# Altium schematic sheet ltk-mw-rx.SchDoc: MW Bench - Receiver
size A3; Organization: Altium Limited; DocumentNumber: 2; Revision: 3.0; SheetNumber: 2; SheetTotal: 3
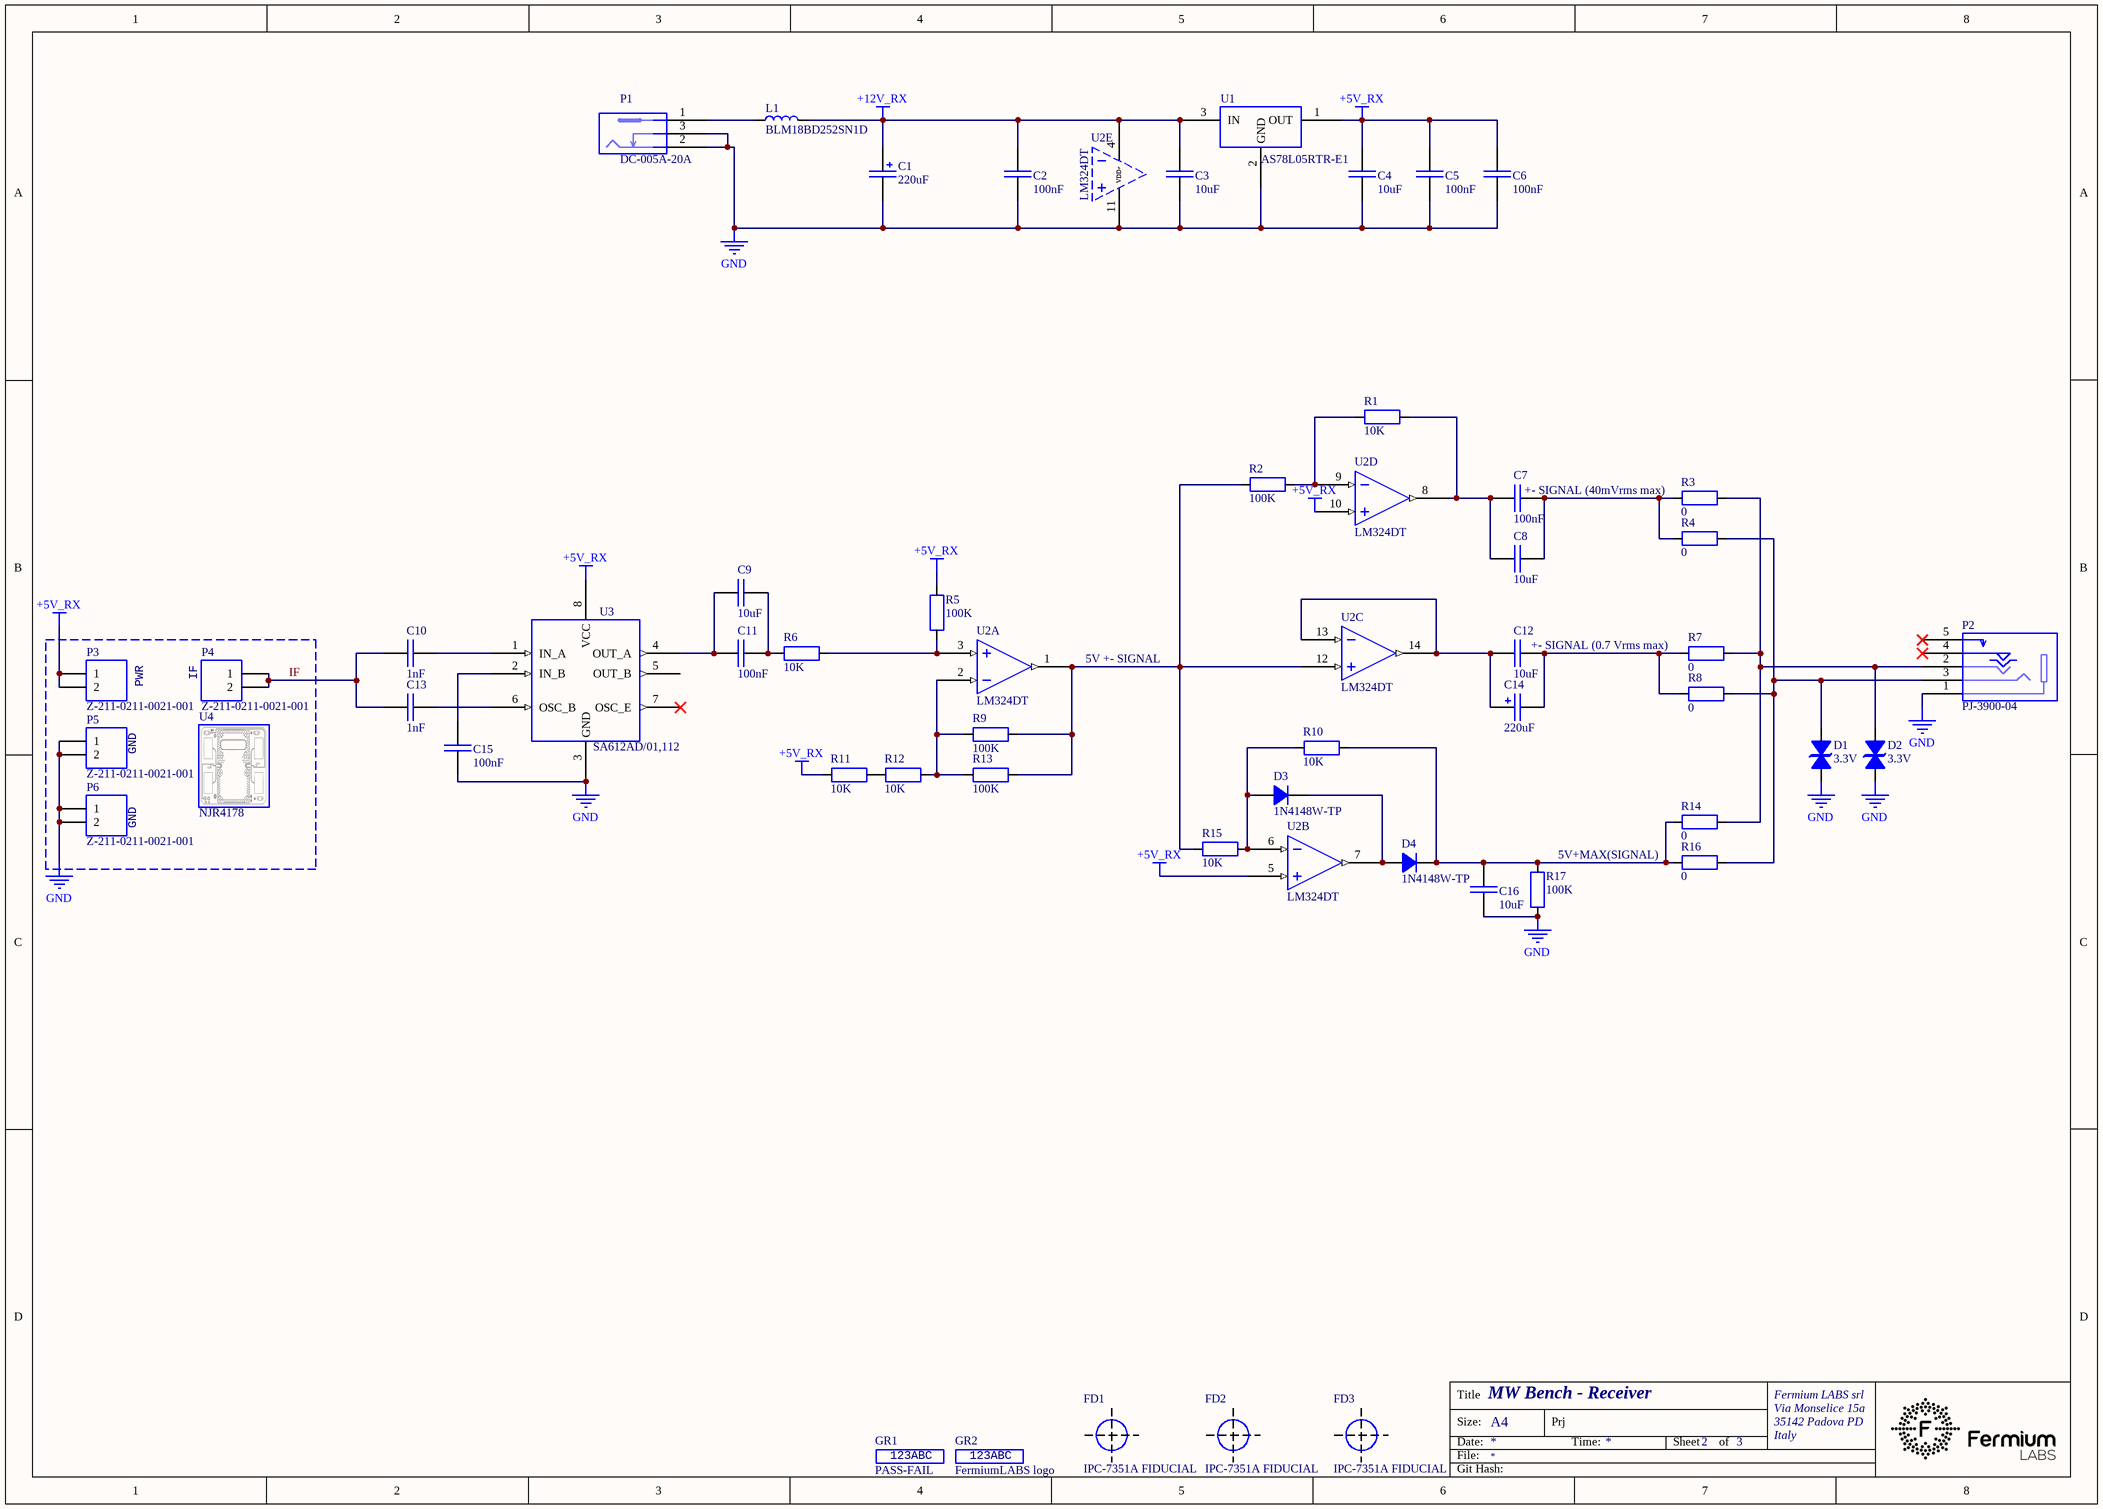
[diagram p0: ltk-mw-rx.SchDoc]

## Parts
C1  220uF  [3924B366-8672-45E9-B0BE-62DACC24E783]
C2  100nF  [CAP 0603_1608]
C3  10uF  [CAP 0805_2012]
C4  10uF  [CAP 0805_2012]
C5  100nF  [CAP 0603_1608]
C6  100nF  [CAP 0603_1608]
C7  100nF  [CAP 0603_1608]
C8  10uF  [CAP 0805_2012]
C9  10uF  [CAP 0805_2012]
C10  1nF  [CAP 0603_1608]
C11  100nF  [CAP 0603_1608]
C12  10uF  [CAP 0805_2012]
C13  1nF  [CAP 0603_1608]
C14  220uF  [3924B366-8672-45E9-B0BE-62DACC24E783]
C15  100nF  [CAP 0603_1608]
C16  10uF  [CAP 0805_2012]
D1  3.3V  [SOD523F]
D2  3.3V  [SOD523F]
D3  1N4148W-TP  [SOD-123]
D4  1N4148W-TP  [SOD-123]
FD1  IPC-7351A FIDUCIAL  [FIDUCIAL-IPC-7351A]  (no BOM)
FD2  IPC-7351A FIDUCIAL  [FIDUCIAL-IPC-7351A]  (no BOM)
FD3  IPC-7351A FIDUCIAL  [FIDUCIAL-IPC-7351A]  (no BOM)
GR1  PASS-FAIL  [0B1556B7-A534-4801-B57D-01EFA34B1205]  (no BOM)
GR2  FermiumLABS logo  [5394DE47-A0E8-4329-8464-7791B7C19310]  (no BOM)
L1  BLM18BD252SN1D  [FER 0603_1608]
P1  DC-005A-20A  [F0972D8A-C5C0-4A84-836D-A9666EE65C2D]
P2  PJ-3900-04  [7EF2B92C-0FC9-4C85-B662-5CEC65BFCCC4]
P3  Z-211-0211-0021-001  [0FBEB40D-2B6D-43C7-945F-A2D40A82B953]
P4  Z-211-0211-0021-001  [0FBEB40D-2B6D-43C7-945F-A2D40A82B953]
P5  Z-211-0211-0021-001  [0FBEB40D-2B6D-43C7-945F-A2D40A82B953]
P6  Z-211-0211-0021-001  [0FBEB40D-2B6D-43C7-945F-A2D40A82B953]
R1  10K  [RES 0603_1608]
R2  100K  [RES 0603_1608]
R3  0  [RES 0603_1608]
R4  0  [RES 0603_1608]
R5  100K  [RES 0603_1608]
R6  10K  [RES 0603_1608]
R7  0  [RES 0603_1608]
R8  0  [RES 0603_1608]
R9  100K  [RES 0603_1608]
R10  10K  [RES 0603_1608]
R11  10K  [RES 0603_1608]
R12  10K  [RES 0603_1608]
R13  100K  [RES 0603_1608]
R14  0  [RES 0603_1608]
R15  10K  [RES 0603_1608]
R16  0  [RES 0603_1608]
R17  100K  [RES 0603_1608]
U1  AS78L05RTR-E1  [E733EFB9-FE91-4AE9-9197-29251971C3DC]
U2  LM324DT  [34355DA5-B1DA-47C2-A88A-ECF82120A4F7]  (parts A,B,C,D,E of 5)
U3  SA612AD/01,112  [TI SOIC-8 D]
U4  NJR4178  [25B19271-CD6F-4BC8-A99B-F617D566DC9C]

## Nets
+5V_RX: C4.2 C5.2 C6.2 P3.1 P3.2 R5.1 R11.2 U1.1(OUT) U2.5(IN+) U2.10(IN+) U3.8(VCC)
+12V_RX: C1.1 C2.2 C3.2 L1.2 U1.3(IN) U2.4(VDD+)
GND: C1.2 C2.1 C3.1 C4.1 C5.1 C6.1 C15.2 C16.2 D1.2 D2.2 P1.2 P1.3 P2.1(GND) P5.1 P5.2 P6.1 P6.2 R17.1 U1.2(GND) U2.11(VDD-) U3.3(GND)
IF: C10.1 C13.1 P4.1 P4.2
NetC7_1: C7.1 C8.1 R1.1 U2.8(OUT)
NetC7_2: C7.2 C8.2 R3.2 R4.2
NetC9_1: C9.1 C11.1 U3.4(OUT_A)
NetC9_2: C9.2 C11.2 R6.2
NetC10_2: C10.2 U3.1(IN_A)
NetC12_1: C12.1 C14.2 R7.2 R8.2
NetC12_2: C12.2 C14.1 U2.13(IN-) U2.14(OUT)
NetC13_2: C13.2 U3.6(OSC_B)
NetC15_1: C15.1 U3.2(IN_B)
NetC16_1: C16.1 D4.1(K) R10.1 R14.2 R16.2 R17.2
NetD1_1: D1.1 P2.3(L) R4.1 R8.1 R16.1
NetD2_1: D2.1 P2.2(R) R3.1 R7.1 R14.1
NetD3_1: D3.1(K) D4.2(A) U2.7(OUT)
NetD3_2: D3.2(A) R10.2 R15.1 U2.6(IN-)
NetL1_1: L1.1 P1.1
NetR1_2: R1.2 R2.1 U2.9(IN-)
NetR2_2: R2.2 R9.1 R13.1 R15.2 U2.1(OUT) U2.12(IN+)
NetR5_2: R5.2 R6.1 U2.3(IN+)
NetR9_2: R9.2 R12.1 R13.2 U2.2(IN-)
NetR11_1: R11.1 R12.2

Not connected (* = marked no-connect by the designer): P2 4(AUX)* 5(AUX)*; U3 5(OUT_B) 7(OSC_E)*

## Notes on the sheet
- (near C7) +- SIGNAL (40mVrms max)
- +- SIGNAL (0.7 Vrms max)
- PWR
- (near P4) IF
- 5V +- SIGNAL
- GND
- (near R17) 5V+MAX(SIGNAL)
- Title
- Fermium LABS srl
- Size:
- Date:
- File:
- A4
- Prj
- Time:
- Sheet
- of
- Via Monselice 15a
- 35142 Padova PD
- Italy
- Git Hash:
- (in symbol 50f8ea88-0034-49fe-a263-d8e97bc35e2f) 123ABC
- (in symbol d1abe19f-3fed-4f20-b2ed-afc0ffbc6628) 123ABC

## Library data of the parts
C1 C14 = 1a28df19-6d3e-4a71-836c-f22920f8e8ab: CAP  THT ELEC 220uF 25V 20%; Manufacturer 1: Rubycon; Manufacturer Part Number 1: 25PK220MEFC-6.3*11; id: 14782; S 1: LCSC; SPN 1: C109337; Part Number: 1a28df19-6d3e-4a71-836c-f22920f8e8ab; ComponentLink1Description: Datasheet; ComponentLink1URL: http://localhost:8080/static/files/Rubycon-220uF-25V_C109337_12019-03-10_214953.757848.pdf?Rubycon-220uF-25V_C109337 (1).pdf; Value: 220uF
C2 C5-C7 C11 C15 = 02841f84-ac15-41b5-9e17-915f8f067828: CAP SMD MLCC 100nF 25V 0603 X7R; Manufacturer 1: Samsung Electro-Mechanics; Manufacturer Part Number 1: CL10B104KA8NNNC; id: 14784; S 1: LCSC; SPN 1: C1590; Part Number: 02841f84-ac15-41b5-9e17-915f8f067828; ComponentLink1Description: Datasheet; ComponentLink1URL: http://localhost:8080/static/files/Samsung-Electro-Mechanics-CL10B104KA8NNNC_C15902019-03-10_215548.826887.pdf?Samsung-Electro-Mechanics-CL10B104KA8NNNC_C1590.pdf; Value: 100nF
C3 C4 C8 C9 C12 C16 = 1ffbe5a9-0884-4740-bdad-20a6a98400e6: CAP SMD MLCC 10uF 25V 0805 X5R; Manufacturer 1: Samsung Electro-Mechanics; Manufacturer Part Number 1: CL21A106KAYNNNE; id: 14779; S 1: LCSC; SPN 1: C84416; SPN 2: C15850; Part Number: 1ffbe5a9-0884-4740-bdad-20a6a98400e6; ComponentLink1Description: Datasheet; ComponentLink1URL: http://localhost:8080/static/files/Samsung-Electro-Mechanics-CL21A106KAYNNNE_C158502019-03-10_213827.610739.pdf?Samsung-Electro-Mechanics-CL21A106KAYNNNE_C15850.pdf; Value: 10uF; Manufacturer 2: Murata; Manufacturer Part Number 2: GRM21BR61E106KA73L; S 2: LCSC
C10 C13 = 0eca2548-3630-4fea-a3d5-94248c1cae74: CAP SMD MLCC 1nF 50V 0603 X7R; Manufacturer 1: Samsung Electro-Mechanics; Manufacturer Part Number 1: CL10B102KB8NNNC; id: 14785; S 1: LCSC; SPN 1: C1588; Part Number: 0eca2548-3630-4fea-a3d5-94248c1cae74; ComponentLink1Description: Datasheet; ComponentLink1URL: http://localhost:8080/static/files/Samsung-Electro-Mechanics-CL10B102KB8NNNC_C1588_12019-03-10_215732.131818.pdf?Samsung-Electro-Mechanics-CL10B102KB8NNNC_C1588 (1).pdf; Value: 1nF
D1 D2 = d6266fd0-7428-4fb9-a062-338cdce926fd: DIODE SMD TVS 3.3V BIDIRECTIONAL SOD-523; Manufacturer 1: Born Semiconductor; Manufacturer Part Number 1: PESD3V3S1BA-N; id: 14798; S 1: LCSC; SPN 1: C85377; SPN 2: C316037; Part Number: d6266fd0-7428-4fb9-a062-338cdce926fd; ComponentLink1Description: Datasheet; ComponentLink1URL: http://localhost:8080/static/files/Bourne-Semicon-Shenzhen-PESD3V3S1BA-N_C3160372019-04-07_002431.794112.pdf?Bourne-Semicon-Shenzhen-PESD3V3S1BA-N_C316037.pdf; Value: 3.3V; ComponentLink2Description: Datasheet; ComponentLink2URL: http://localhost:8080/static/files/Nexperia-PESD3V3S1UB115-datasheet2019-08-16_201415.198759.pdf?Nexperia-PESD3V3S1UB,115-datasheet.pdf; Manufacturer 2: Nexperia; Manufacturer Part Number 2: PESD3V3S1UB,115; S 2: LCSC
D3 D4 = 5e920700-75df-48e3-84dd-8f9f777caed8: DIODE SMD 100V 150mA 1.5Vf SOD-123 4148; Manufacturer 1: MCC; id: 14795; S 1: LCSC; SPN 1: C77978; Part Number: 5e920700-75df-48e3-84dd-8f9f777caed8; ComponentLink1Description: Datasheet; ComponentLink1URL: http://localhost:8080/static/files/Micro-Commercial-Components-MCC-1N4148W-TP_C779782019-04-06_215019.428643.pdf?Micro-Commercial-Components-MCC-1N4148W-TP_C77978.pdf; Manufacturer Part Number 1: 1N4148W-TP
FD1-FD3 = 19da4612-eb95-43bb-9984-553a52b2a224: GRAPHICS FIDUCIAL IPC-7351A; id: 14800; Part Number: 19da4612-eb95-43bb-9984-553a52b2a224
GR1 = d1abe19f-3fed-4f20-b2ed-afc0ffbc6628: GRAPHICS PASS-FAIL MARK; id: 14801; Part Number: d1abe19f-3fed-4f20-b2ed-afc0ffbc6628
GR2 = 50f8ea88-0034-49fe-a263-d8e97bc35e2f: GRAPHICS LOGO FERMIUM LABS SRL; id: 14799; Part Number: 50f8ea88-0034-49fe-a263-d8e97bc35e2f
L1 = c9e30ae8-9d5b-4135-a079-b1147da846d8: FER SMD CHIP 0603 400mA 1k@100MHz 500mOhm; Manufacturer 1: Murata; id: 14786; S 1: LCSC; SPN 1: C77668; Part Number: c9e30ae8-9d5b-4135-a079-b1147da846d8; ComponentLink1Description: Datasheet; ComponentLink1URL: http://localhost:8080/static/files/Murata-Electronics-BLM18AG102SN1D_C858242019-03-10_220021.186607.pdf?Murata-Electronics-BLM18AG102SN1D_C85824.pdf; Manufacturer Part Number 1: BLM18BD252SN1D
P1 = b53db51a-1725-412b-9039-fa7a45c7c438: CONN THT DC JACK 0.5A 30VDC 5Kcycles; Manufacturer 1: HRO Electronics; id: 14780; S 1: LCSC; SPN 1: C191049; Part Number: b53db51a-1725-412b-9039-fa7a45c7c438; ComponentLink1Description: Datasheet; ComponentLink1URL: http://localhost:8080/static/files/Korean-Hroparts-Elec-DC-005A-20A_C191049_22019-03-10_214231.486078.pdf?Korean-Hroparts-Elec-DC-005A-20A_C191049 (2).pdf; Manufacturer Part Number 1: DC-005A-20A
P2 = 80507a24-5d7c-4cf5-953e-f54832d54564: CONN THT 3.5mm AUDIO STEREO AUX SWITCH; Manufacturer 1: HRO Electronics; id: 14793; S 1: LCSC; SPN 1: C151839; Part Number: 80507a24-5d7c-4cf5-953e-f54832d54564; ComponentLink1Description: Datasheet; ComponentLink1URL: http://localhost:8080/static/files/Korean-Hroparts-Elec-PJ-3900-04_C1518392019-04-10_231144.687617.pdf?Korean-Hroparts-Elec-PJ-3900-04_C151839.pdf; Manufacturer Part Number 1: PJ-3900-04
P3-P6 = fb9043ef-1dd5-4a9c-8c1a-da0c667690ac: CONN THT PIN HEADER 2P MALE 2.54mm; Manufacturer 1: Nextronics Engineering; id: 14796; S 1: LCSC; SPN 1: C225477; SPN 2: C152154; SPN 3: C124375; Part Number: fb9043ef-1dd5-4a9c-8c1a-da0c667690ac; ComponentLink1Description: Datasheet; ComponentLink1URL: http://localhost:8080/static/files/Shenzhen-Cankemeng-Headers-Pins-1-2P-2-54mm-Straight-line_C1243752019-04-06_220043.339618.pdf?Shenzhen-Cankemeng-Headers-Pins-1-2P-2-54mm-Straight-line_C124375.pdf; ComponentLink2Description: Datasheet; ComponentLink2URL: http://localhost:8080/static/files/Nextronics-Engineering-Z-211-0211-0021-001_C1521542019-04-06_220050.159477.pdf?Nextronics-Engineering-Z-211-0211-0021-001_C152154.pdf; ComponentLink3Description: Datasheet; ComponentLink3URL: http://localhost:8080/static/files/Changjiang-Connectors-A2541WV-2P_C2254772019-04-06_220058.382973.pdf?Changjiang-Connectors-A2541WV-2P_C225477.pdf; Manufacturer 2: Changjiang Connectors; Manufacturer 3: Shenzhen Cankemeng; Manufacturer Part Number 1: Z-211-0211-0021-001; Manufacturer Part Number 2: A2541WV-2P; Manufacturer Part Number 3: ---; S 2: LCSC; S 3: LCSC
R1 R6 R10-R12 R15 = 93242766-ba1d-462d-b58f-ce1dfc4129c8: RES SMD 10K OHM 1% 1/10W 0603; Manufacturer 1: Yageo; Manufacturer Part Number 1: RC0603FR-0710KL; id: 12101; S 1: LCSC; SPN 1: C98220; Part Number: 93242766-ba1d-462d-b58f-ce1dfc4129c8; Value: 10K
R2 R5 R9 R13 R17 = 76af10b3-9d85-4b5c-a2d6-26cc74f432f7: RES SMD 100K OHM 1% 1/10W 0603; Manufacturer 1: Yageo; Manufacturer Part Number 1: RC0603FR-07100KL; id: 12746; S 1: LCSC; SPN 1: C14675; Part Number: 76af10b3-9d85-4b5c-a2d6-26cc74f432f7; Value: 100K
R3 R4 R7 R8 R14 R16 = 6ae227f9-847f-4766-8522-e11a83531204: RES SMD 0 OHM 5% 1/10W 0603; Manufacturer 1: Yageo; Manufacturer Part Number 1: RC0603JR-070RL; id: 11973; S 1: LCSC; SPN 1: C95177; Part Number: 6ae227f9-847f-4766-8522-e11a83531204; Value: 0
U1 = fd64863e-487f-4688-b264-696c0ba5456b: IC SMD LINEAR VOLTAGE REGULATOR 5V 100mA SOT-89; Manufacturer 1: Diodes Inc.; id: 14783; S 1: LCSC; SPN 1: C90471; SPN 2: C90763; Part Number: fd64863e-487f-4688-b264-696c0ba5456b; ComponentLink1Description: Datasheet; ComponentLink1URL: http://localhost:8080/static/files/Diodes-Incorporated-AS78L05RTR-E1_C90471_12019-03-10_215252.941962.pdf?Diodes-Incorporated-AS78L05RTR-E1_C90471 (1).pdf; ComponentLink2Description: Datasheet; ComponentLink2URL: http://localhost:8080/static/files/KIA-Semicon-Tech-KIA78L05T_C90763_12019-03-10_215415.523371.pdf?KIA-Semicon-Tech-KIA78L05T_C90763 (1).pdf; Manufacturer 2: KIA Semicon Tech; Manufacturer Part Number 1: AS78L05RTR-E1; Manufacturer Part Number 2: KIA78L05T; S 2: LCSC
U2 = 21a85167-c328-42f7-a52e-365842c6dad3: IC SMD OPAMP LM324DT SO-14; Manufacturer 1: ST Microelectronics; id: 14792; S 1: LCSC; SPN 1: C71035; Part Number: 21a85167-c328-42f7-a52e-365842c6dad3; ComponentLink1Description: Datasheet; ComponentLink1URL: http://localhost:8080/static/files/STMicroelectronics-LM324DT_C710352019-04-06_191500.254110.pdf?STMicroelectronics-LM324DT_C71035.pdf; Manufacturer Part Number 1: LM324DT
U3 = a9622f6c-68f2-4f08-abc9-76f38977fdd3: IC SMD RF MIXER SA612A SOIC-8; Manufacturer 1: NXP Semiconductors; id: 14790; S 1: Ameya360; SPN 2: SA612AD/01,118; Part Number: a9622f6c-68f2-4f08-abc9-76f38977fdd3; ComponentLink1Description: Datasheet; ComponentLink1URL: http://localhost:8080/static/files/SA612AD-01118-Philips2019-03-11_010245.512050.pdf?SA612AD-01,118-Philips.pdf; ComponentLink2Description: Datasheet; ComponentLink2URL: http://localhost:8080/static/files/NXP_Semiconductors-SA612AD_01118-datasheet_32019-03-11_010254.258631.pdf?NXP_Semiconductors-SA612AD_01,118-datasheet (3).pdf; ComponentLink3Description: RoHS Statement; ComponentLink3URL: http://localhost:8080/static/files/NXP_Semiconductors-rohs_statement2019-03-11_010314.569812.pdf?NXP_Semiconductors-rohs_statement.pdf; Manufacturer Part Number 1: SA612AD/01,112; Manufacturer 2: NXP Semiconductors; Manufacturer Part Number 2: SA612AD/01,118; S 2: Ameya360; S 3: Ameya360; S 4: Ameya360; S 5: Ameya360; S 6: Ameya360; S 7: Ameya360; S 8: Ameya360; SPN 1: SA612AD/01,112; SPN 3: SA612AD/01,112; SPN 4: SA612AD/01,118; SPN 5: SA612AD/01,112; SPN 6: SA612AD/01,118; SPN 7: SA612AD/01,112; SPN 8: SA612AD/01,118
U4 = f0e19a38-18de-4253-8da2-aebb0c4083bd: MODULE THT RADAR DOPPLER 10.525GHz NJR4178; Manufacturer 1: New Japan Radio; id: 14789; S 1: CONSYSTEM srl (Italy); SPN 1: JM417800-LF; Part Number: f0e19a38-18de-4253-8da2-aebb0c4083bd; ComponentLink1Description: Datasheet; ComponentLink1URL: http://localhost:8080/static/files/Xdoppler_NJR41767881_rev032019-03-10_230533.619662.pdf?Xdoppler_NJR4176^78^81_rev03.pdf; ComponentLink2Description: Corrispondence; ComponentLink2URL: http://localhost:8080/static/files/FERMIUM_LABS_Moduli_NJR41782019-03-10_230730.901712.pdf?FERMIUM LABS  Moduli NJR4178.pdf; ComponentLink3Description: Quote; ComponentLink3URL: http://localhost:8080/static/files/201812111056099982019-03-10_230743.103809.pdf?20181211105609998.pdf; ComponentLink4Description: Product Page; ComponentLink4URL: https://micro.njr.com/eng/products/sensor/doppler/r4178.html; Manufacturer Part Number 1: NJR4178